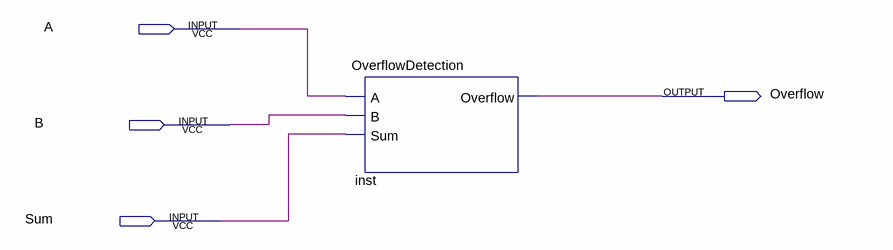
[diagram p0: schematic sheet]
// Quartus schematic TestOverflow.bdf as structural Verilog: 1 symbols, 4 pins
module TestOverflow (
  input  A,
  input  B,
  input  Sum,
  output Overflow
);

  OverflowDetection inst (.A(A), .B(B), .Sum(Sum), .Overflow(Overflow));
endmodule
